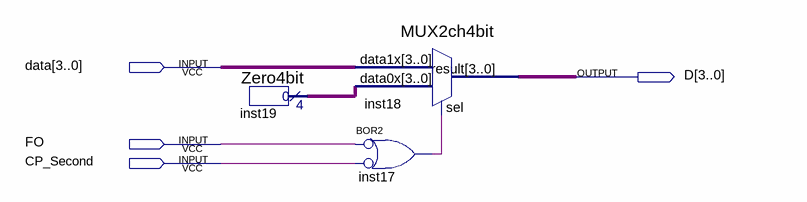
[diagram p0: schematic sheet]
// Quartus schematic NumberFlashControler.bdf as structural Verilog: 3 symbols, 4 pins
module NumberFlashControler (
  input  [3:0] data,
  input  FO,
  input  CP_Second,
  output [3:0] D
);

  wire inst17_out;
  wire [3:0] inst19_result;

  Zero4bit inst19 (.result(inst19_result));
  MUX2ch4bit inst18 (.data1x(data), .data0x(inst19_result), .sel(inst17_out), .result(D));
  or inst17 (inst17_out, ~FO, ~CP_Second);  // BOR2
endmodule
